# EAGLE schematic Controllerv2.s#7 (EAGLE 9.1.3)

## Sheet 1 of 2
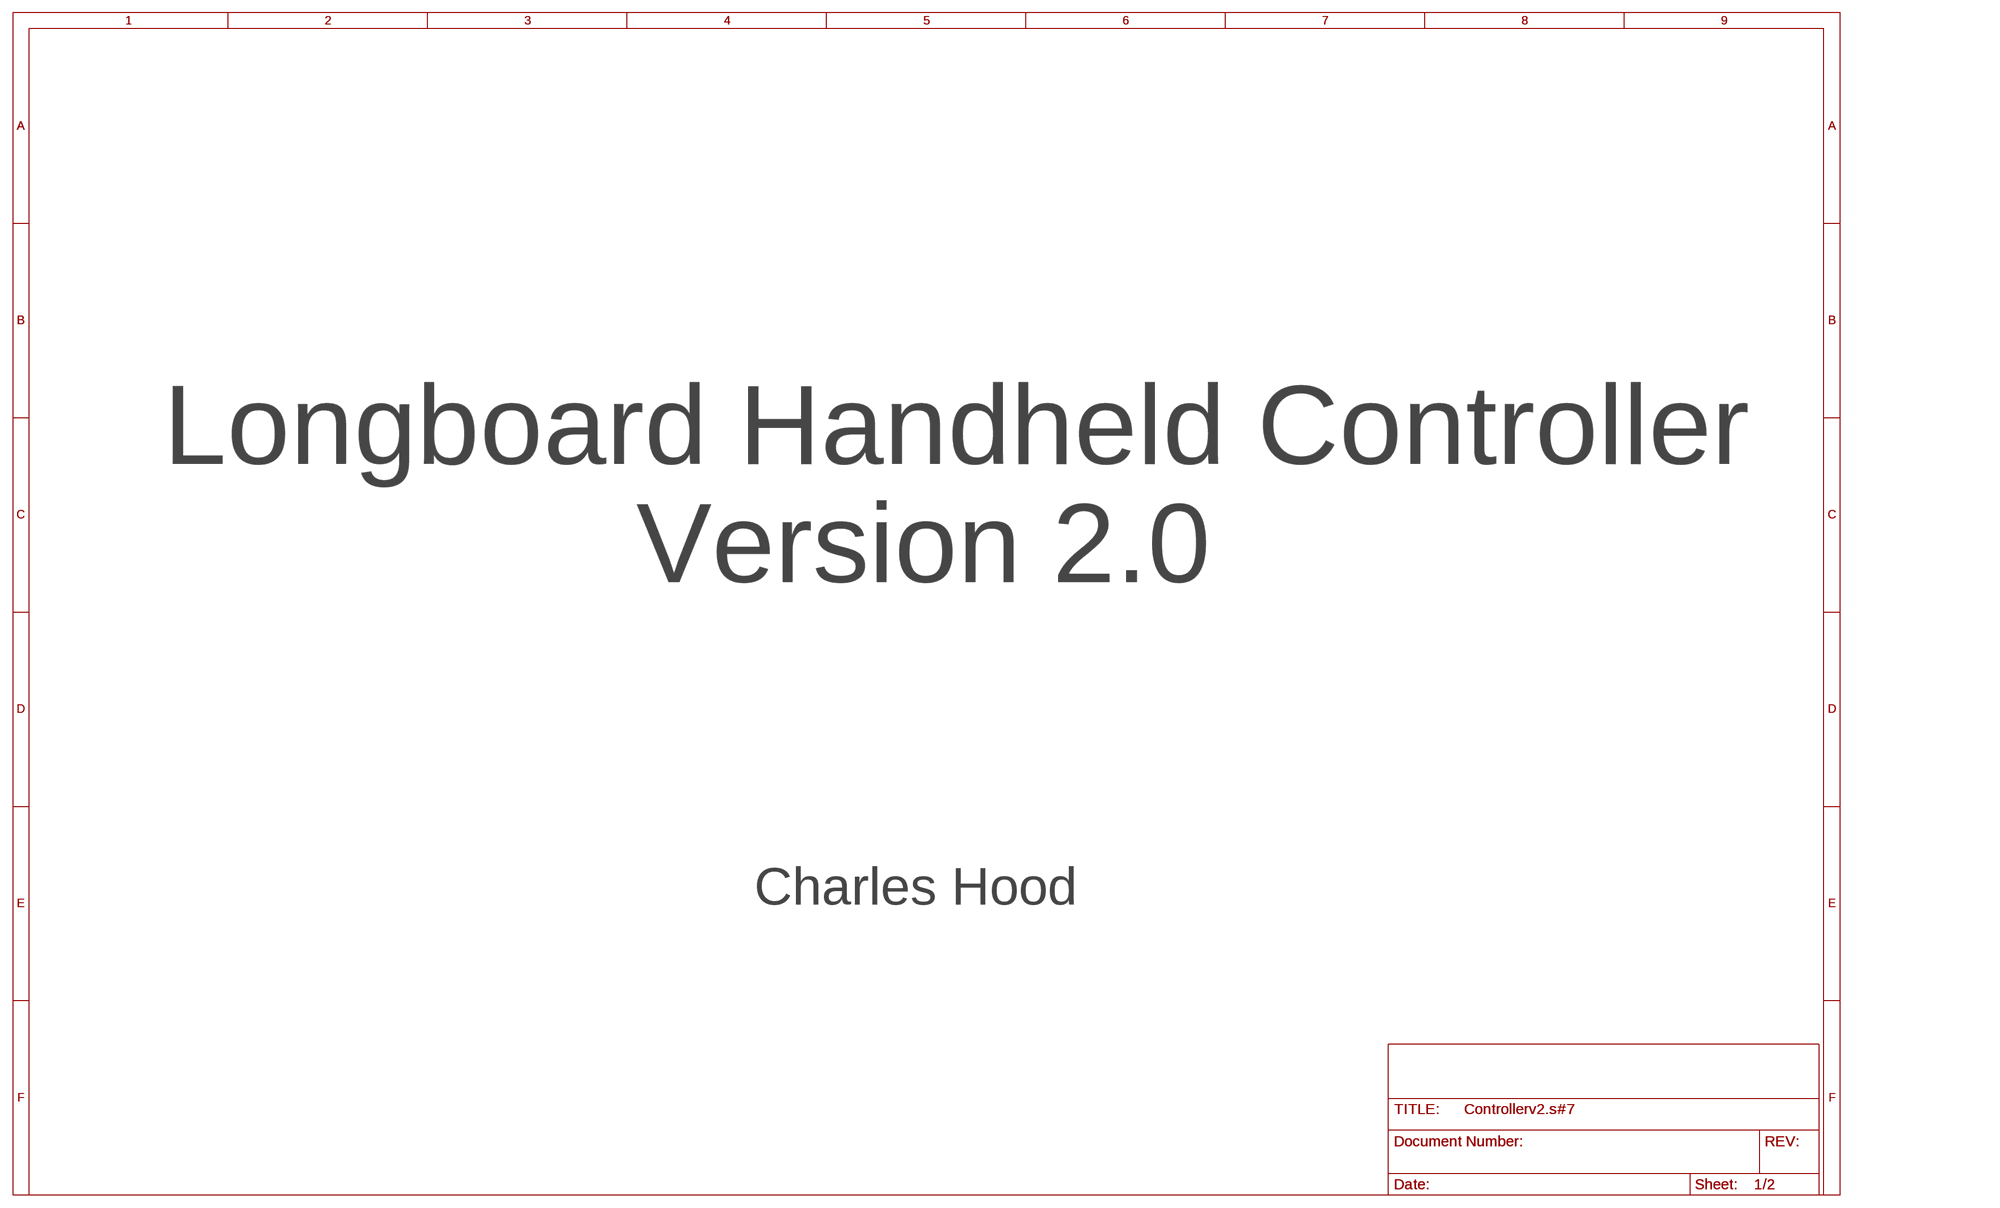
[diagram p0: schematic, sheet 1]

### Notes on the sheet
- Longboard Handheld Controller
- Version 2.0
- Charles Hood

## Sheet 2 of 2
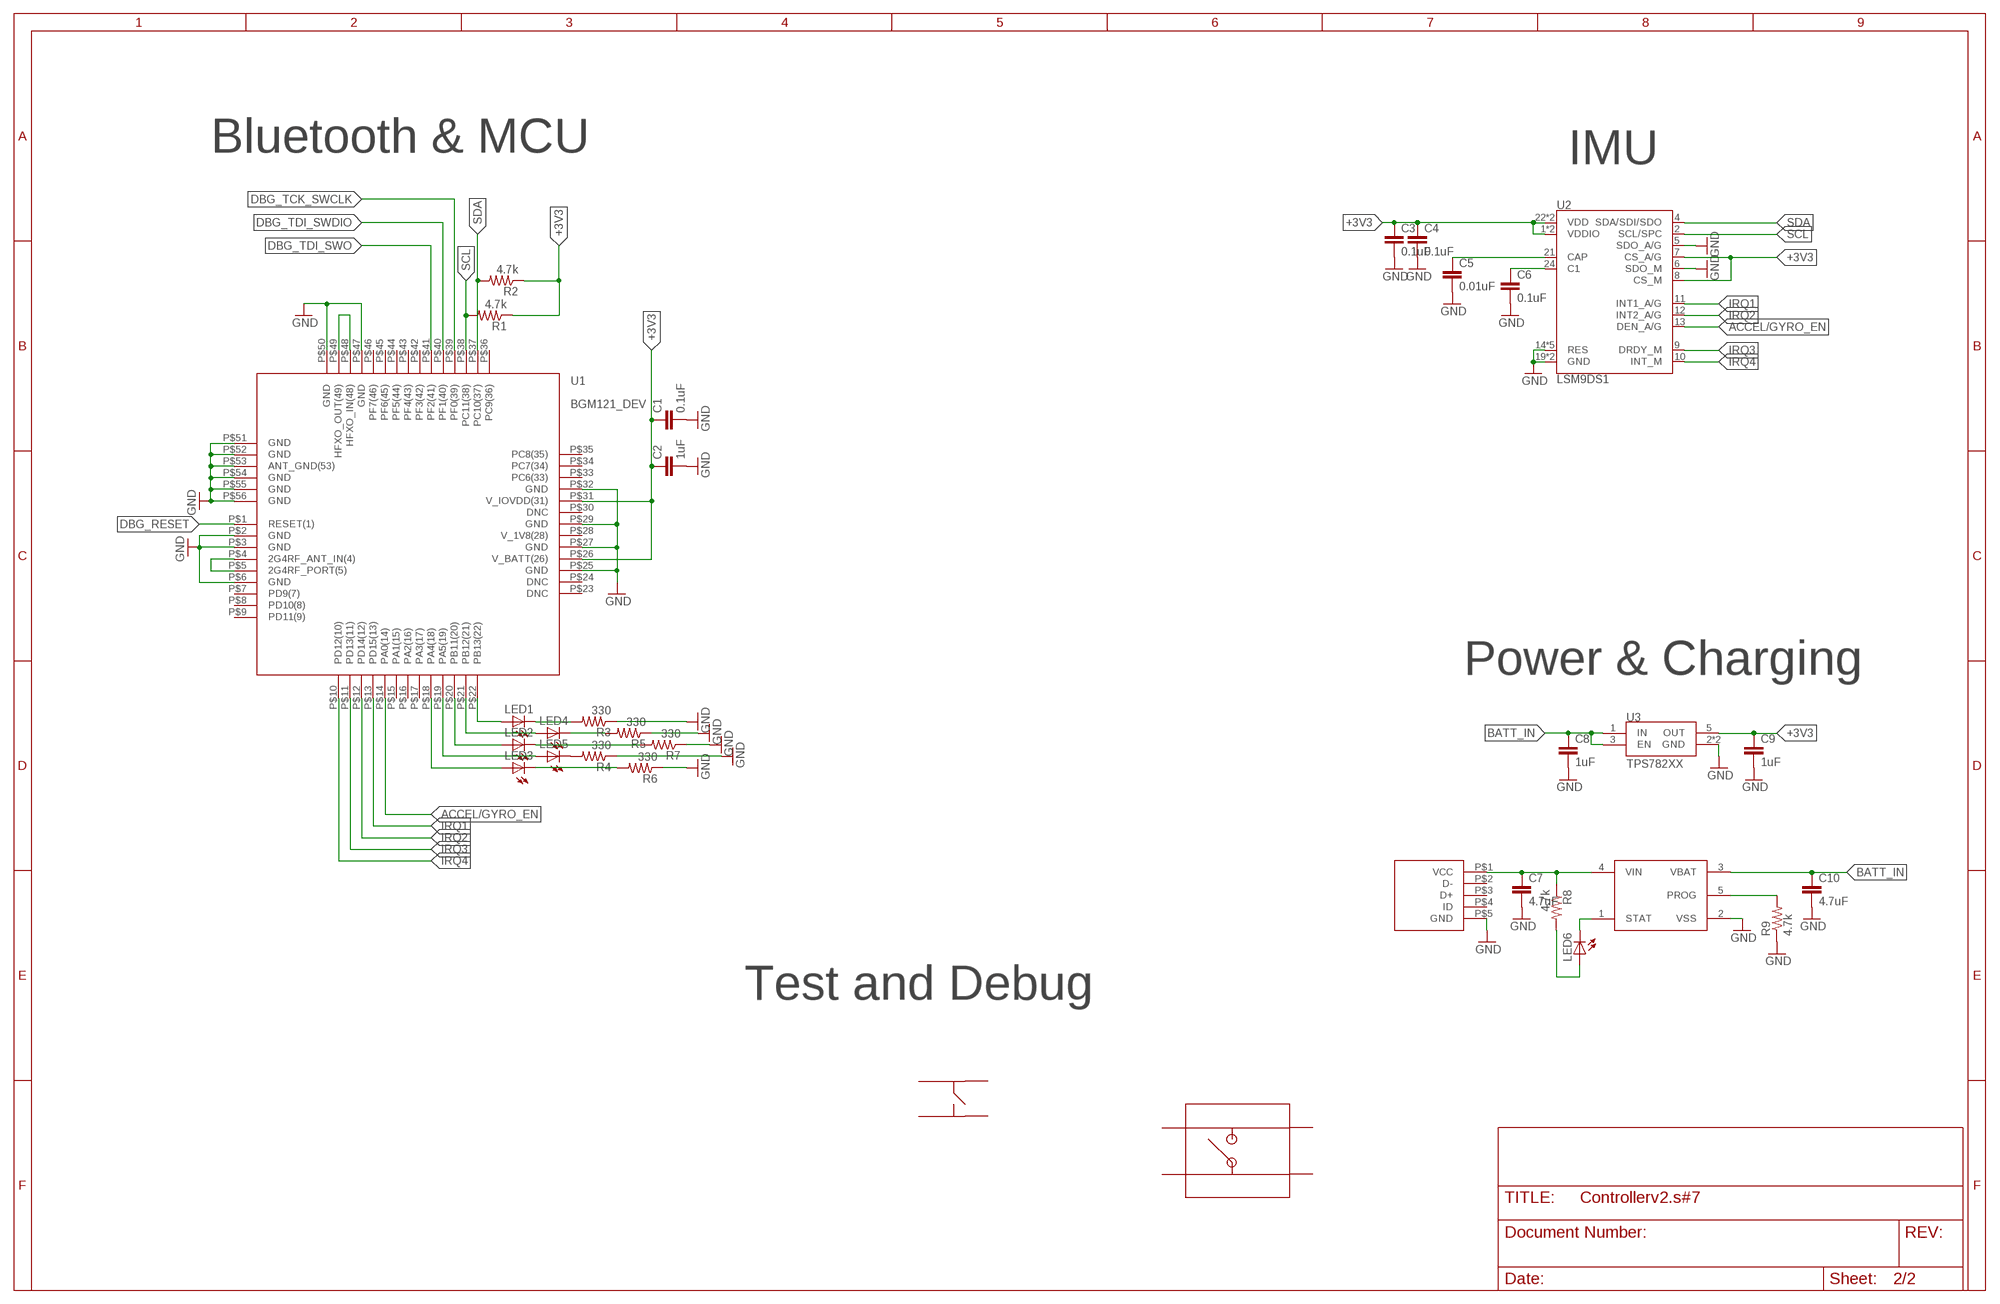
[diagram p1: schematic, sheet 2]

### Parts
C1  0.1uF  C-EUC0201  [C0201]
C2  1uF  C-EUC0201  [C0201]
C3  0.1uF  C-EUC0201  [C0201]
C4  0.1uF  C-EUC0201  [C0201]
C5  0.01uF  C-EUC0201  [C0201]
C6  0.1uF  C-EUC0201  [C0201]
C7  4.7uF  C-EUC0402  [C0402]
C8  1uF  C-EUC0201  [C0201]
C9  1uF  C-EUC0201  [C0201]
C10  4.7uF  C-EUC0402  [C0402]
J1  MICRO_USB  [MOLEX_USB]
LED1  LEDCHIP-LED0603  [CHIP-LED0603]
LED2  LEDCHIP-LED0603  [CHIP-LED0603]
LED3  LEDCHIP-LED0603  [CHIP-LED0603]
LED4  LEDCHIP-LED0603  [CHIP-LED0603]
LED5  LEDCHIP-LED0603  [CHIP-LED0603]
LED6  LEDCHIP-LED0603  [CHIP-LED0603]
R1  4.7k  R-US_R0201  [R0201]
R2  4.7k  R-US_R0201  [R0201]
R3  330  R-US_R0201  [R0201]
R4  330  R-US_R0201  [R0201]
R5  330  R-US_R0201  [R0201]
R6  330  R-US_R0201  [R0201]
R7  330  R-US_R0201  [R0201]
R8  4.7k  R-US_R0201  [R0201]
R9  4.7k  R-US_R0201  [R0201]
S1  KMR731NG  [KMR731NG]
S3  PTS840  [PTS840]
U1  BGM121_DEV  [BGM121_PAC]
U2  LSM9DS1  [LGA24-8X4]
U3  TPS782XX  [SOT23-5L]
U4  MCP73831  [SOT23-5L]

### Nets
+3V3: C1.1 C2.1 C3.1 C4.1 C9.1 R1.1 R2.1 U1.P$26(V_BATT(26)) U1.P$31(V_IOVDD(31)) U2.1(VDDIO) U2.3(VDDIO) U2.7(CS_A/G) U2.8(CS_M) U2.22(VDD) U2.23(VDD) U3.5(OUT)
ACCEL/GYRO_EN: U1.P$14(PA0(14)) U2.13(DEN_A/G)
BATT_IN: C8.1 C10.1 U3.1(IN) U3.3(EN) U4.3(VBAT)
DBG_RESET: U1.P$1(RESET(1))
DBG_TCK_SWCLK: U1.P$39(PF0(39))
DBG_TDI_SWDIO: U1.P$40(PF1(40))
DBG_TDI_SWO: U1.P$41(PF2(41))
GND: C1.2 C2.2 C3.2 C4.2 C5.2 C6.2 C7.2 C8.2 C9.2 C10.2 J1.P$5(GND) R3.1 R4.1 R5.1 R6.1 R7.1 R9.1 U1.P$2(GND) U1.P$3(GND) U1.P$6(GND) U1.P$25(GND) U1.P$27(GND) U1.P$29(GND) U1.P$32(GND) U1.P$47(GND) U1.P$50(GND) U1.P$51(GND) U1.P$52(GND) U1.P$53(ANT_GND(53)) U1.P$54(GND) U1.P$55(GND) U1.P$56(GND) U2.5(SDO_A/G) U2.6(SDO_M) U2.14(RES) U2.15(RES) U2.16(RES) U2.17(RES) U2.18(RES) U2.19(GND) U2.20(GND) U3.2(GND) U3.4(GND) U4.2(VSS)
IRQ1: U1.P$13(PD15(13)) U2.11(INT1_A/G)
IRQ2: U1.P$12(PD14(12)) U2.12(INT2_A/G)
IRQ3: U1.P$11(PD13(11)) U2.9(DRDY_M)
IRQ4: U1.P$10(PD12(10)) U2.10(INT_M)
N$1: LED1.A U1.P$22(PB13(22))
N$2: LED4.A U1.P$21(PB12(21))
N$3: LED2.A U1.P$20(PB11(20))
N$4: LED5.A U1.P$19(PA5(19))
N$5: LED3.C R6.2
N$6: LED3.A U1.P$18(PA4(18))
N$7: C5.1 U2.21(CAP)
N$8: C6.1 U2.24(C1)
N$9: C7.1 J1.P$1(VCC) R8.1 U4.4(VIN)
N$10: R9.2 U4.5(PROG)
N$11: LED6.A R8.2
N$12: LED6.C U4.1(STAT)
N$36: LED4.C R5.2
N$42: LED2.C R7.2
N$74: LED5.C R4.2
N$110: U1.P$4(2G4RF_ANT_IN(4)) U1.P$5(2G4RF_PORT(5))
N$112: LED1.C R3.2
N$113: U1.P$48(HFXO_IN(48)) U1.P$49(HFXO_OUT(49))
SCL: R1.2 U1.P$38(PC11(38)) U2.2(SCL/SPC)
SDA: R2.2 U1.P$37(PC10(37)) U2.4(SDA/SDI/SDO)
Unconnected: J1.P$2(D-) J1.P$3(D+) J1.P$4(ID) S1.P$1 S1.P$2 S1.P$3 S1.P$4 S3.1 S3.2 S3.3 S3.4 U1.P$7(PD9(7)) U1.P$8(PD10(8)) U1.P$9(PD11(9)) U1.P$15(PA1(15)) U1.P$16(PA2(16)) U1.P$17(PA3(17)) U1.P$23(DNC) U1.P$24(DNC) U1.P$30(DNC) U1.P$33(PC6(33)) U1.P$34(PC7(34)) U1.P$35(PC8(35)) U1.P$36(PC9(36)) U1.P$42(PF3(42)) U1.P$43(PF4(43)) U1.P$44(PF5(44)) U1.P$45(PF6(45)) U1.P$46(PF7(46))

### Notes on the sheet
- Bluetooth & MCU | IMU
- Power & Charging
- Test and Debug

## Power pins joined to a net without a drawn wire
V_1V8(28): U1.P$28(V_1V8(28))

## Library data of the parts
C1-C10 = rcl:C-EU: CAPACITOR, European symbol; SPICEPREFIX: C
J1 = James_Updated:MICRO_USB: Molex Micro USB AB RA SMD Bottom Mount
LED1-LED6 = adafruit:LED: LED OSRAM: - CHIPLED LG R971, LG N971, LY N971, LG Q971, LY Q971, LO R971, LY R971 LH N974, LH R974 LS Q976, LO Q976, LY Q976 LO Q996 - Hyper CHIPLED LW Q18S LB Q993, LB Q99A, LB R99A - SideLED LS A670, LO A670, LY A670, LG A670, LP A670 LB A673, LV A673, LT A673, LW A673 LH A674 LY A675 LS A676, LA A676, LO A676, LY A676, LW A676 LS A679, LY A679, LG A679 - Hyper Micro SIDELED® LS Y876, LA Y876, LO Y876, LY Y876 LT Y87S - SmartLED LW L88C, LW L88S LB L89C, LB L89S, LG L890 LS L89K, LO L89K, LY L89K LS L896, LA L896, LO L896, LY L896 - TOPLED LS T670, LO T670, LY T670, LG T670, LP T670 LSG T670, LSP T670, LSY T670, LOP T670, LYG T670 LG T671, LOG T671, LSG T671 LB T673, LV T673, LT T673, LW T673 LH T674 LS T676, LA T676, LO T676, LY T676, LB T676, LH T676, LSB T676, LW T676 LB T67C, LV T67C, LT T67C, LS T67K, LO T67K, LY T67K, LW E67C LS E67B, LA E67B, LO E67B, LY E67B, LB E67C, LV E67C, LT E67C LW T67C LS T679, LY T679, LG T679 LS T770, LO T770, LY T770, LG T770, LP T770 LB T773, LV T773, LT T773, LW T773 LH T774 LS E675, LA E675, LY E675, LS T675 LS T776, LA T776, LO T776, LY T776, LB T776 LHGB T686 LT T68C, LB T68C - Hyper Mini TOPLED® LB M676 - Mini TOPLED Santana® LG M470 LS M47K, LO M47K, LY M47K Source: http://www.osram.convergy.de/
R1-R9 = rcl:R-US_: RESISTOR, American symbol; SPICEPREFIX: R
S1 = Charles:KMR731NG: Tactile Switch SPST-NO Top Actuated Surface Mount
S3 = Charles:PTS840: SMD Momentary Switch -12V 50mA -
U1 = BGM121:BGM121_DEV: BGM121 - Blue Gecko BGM111 Bluetooth Smart® SiP Module Technical Specifications: Bluetooth 4.2 compliant Configurable TX power up to +8 dBm Range up to 200 meters ARM® Cortex-M4 @ up to 38.4 MHz Arrow: BGM121A256V1 <https://www.arrow.com/en/products/search?q=bgm121> Digikey: 336-3811-1-ND <https://www.digikey.com/product-search/en/rf-if-and-rfid/rf-transceiver-modules/3539948?k=bgm121> Mouser: 634-BGM121A256V1 <http://www.mouser.com/Search/Refine.aspx?Keyword=bgm121>
U2 = Charles:LSM9DS1: LSM9DS1 3D accelerometer, gyroscope & magnetometer The LSM9DS1 is a system-in-package featuring a 3D digital linear acceleration sensor, a 3D digital angular rate sensor, and a 3D digital magnetic sensor. The LSM9DS1 has a linear acceleration full scale of ±2g/±4g/±8/±16 g, a magnetic field full scale of ±4/±8/±12/±16 gauss and an angular rate of ±245/±500/±2000 dps. The LSM9DS1 includes an I2 C serial bus interface supporting standard and fast mode (100 kHz and 400 kHz) and an SPI serial standard interface. Magnetic, accelerometer and gyroscope sensing can be enabled or set in power-down mode separately for smart power management. The LSM9DS1 is available in a plastic land grid array package (LGA) and it is guaranteed to operate over an extended temperature range from -40 °C to +85 °C.; PROD_ID: IC-12536
U3 = James_Updated:TPS782XX: TPS782 500-nA IQ,150-mA, Ultra-Low Quiescent Current Low-Dropout Linear Regulator
U4 = James_Updated:MCP73831